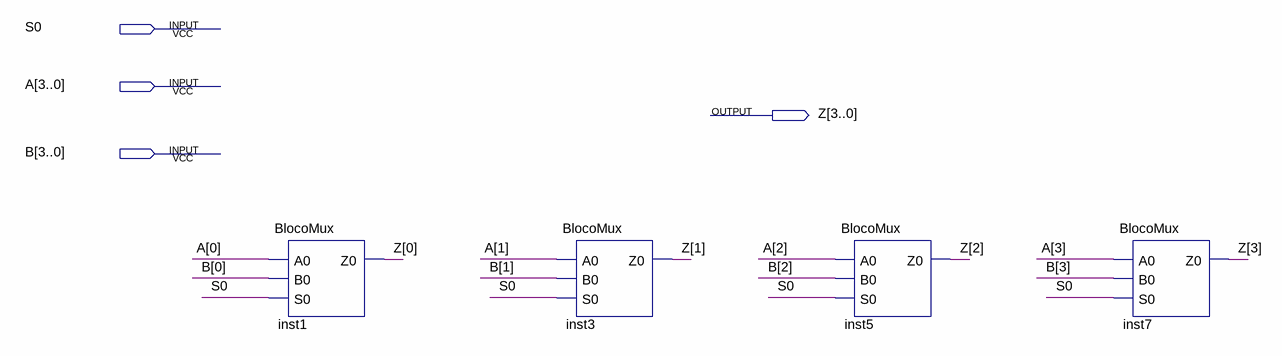
[diagram p0: schematic sheet]
// Quartus schematic MUX2X1_4b.bdf as structural Verilog: 4 symbols, 4 pins
module MUX2X1_4b (
  input  S0,
  input  [3:0] A,
  input  [3:0] B,
  output [3:0] Z
);

  BlocoMux inst1 (.A0(A[0]), .B0(B[0]), .S0(S0), .Z0(Z[0]));
  BlocoMux inst3 (.A0(A[1]), .B0(B[1]), .S0(S0), .Z0(Z[1]));
  BlocoMux inst5 (.A0(A[2]), .B0(B[2]), .S0(S0), .Z0(Z[2]));
  BlocoMux inst7 (.A0(A[3]), .B0(B[3]), .S0(S0), .Z0(Z[3]));
endmodule
